# Altium schematic sheet OLED_BREAKOUT_SCH.SchDoc
size A
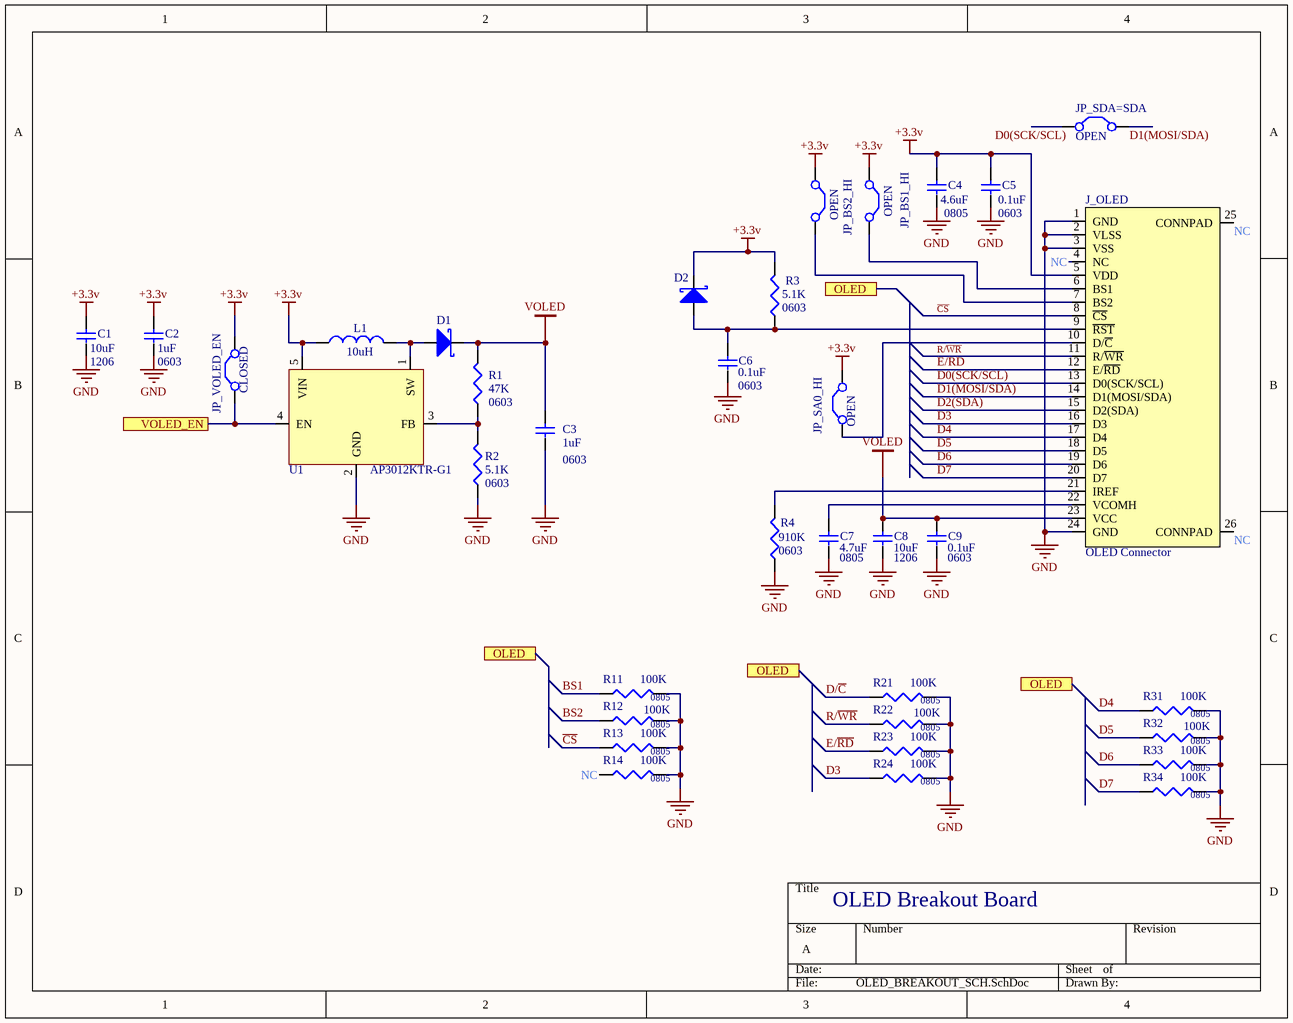
[diagram p0: OLED_BREAKOUT_SCH.SchDoc]

## Parts
C1  Capactiance: 10uF  Size: 1206  [SMD-1206]  (hidden comment: Capacitor)
C2  Capacitance: 1uF  Size: 0603  [SMD-0603]  (hidden comment: Capacitor)
C3  Capacitance: 1uF  Size: 0603  [SMD-0603]  (hidden comment: Capacitor)
C4  Capacitance: 4.6uF  Size: 0805  [SMD-0805]  (hidden comment: Capacitor)
C5  Capacitance: 0.1uF  Size: 0603  [SMD-0603]  (hidden comment: Capacitor)
C6  Capacitance: 0.1uF  Size: 0603  [SMD-0603]  (hidden comment: Capacitor)
C7  Capacitance: 4.7uF  Size: 0805  [SMD-0805]  (hidden comment: Capacitor)
C8  Capacitance: 10uF  Size: 1206  [SMD-1206]  (hidden comment: Capacitor)
C9  Capacitance: 0.1uF  Size: 0603  [SMD-0603]  (hidden comment: Capacitor)
D1  Diode Schottky  [D1_SOD-123]  (value not drawn)
D2  Diode Schottky  [D2_SOD523]  (value not drawn)
J_OLED  OLED Connector  [J_OLED]
JP_BS1_HI  State: OPEN  [SMD-0805]  (hidden comment: Jumper)
JP_BS2_HI  State: OPEN  [SMD-0805]  (hidden comment: Jumper)
JP_SA0_HI  State: OPEN  [SMD-0805]  (hidden comment: Jumper)
JP_SDA=SDA  State: OPEN  [SMD-0805]  (hidden comment: Jumper)
JP_VOLED_EN  State: CLOSED  [SMD-0805]  (hidden comment: Jumper)
L1  Inductance: 10uH  (hidden comment: Inductor)
R1  Resistance: 47K  Size: 0603  [SMD-0603]  (hidden comment: Resistor)
R2  Resistance: 5.1K  Size: 0603  [SMD-0603]  (hidden comment: Resistor)
R3  Resistance: 5.1K  Size: 0603  [SMD-0603]  (hidden comment: Resistor)
R4  Resistance: 910K  Size: 0603  [SMD-0603]  (hidden comment: Resistor)
R11  Resistance: 100K  SIze: 0805  [SMD-0805]  (hidden comment: Resistor)
R12  Resistance: 100K  SIze: 0805  [SMD-0805]  (hidden comment: Resistor)
R13  Resistance: 100K  SIze: 0805  [SMD-0805]  (hidden comment: Resistor)
R14  Resistance: 100K  SIze: 0805  [SMD-0805]  (hidden comment: Resistor)
R21  Resistance: 100K  SIze: 0805  [SMD-0805]  (hidden comment: Resistor)
R22  Resistance: 100K  SIze: 0805  [SMD-0805]  (hidden comment: Resistor)
R23  Resistance: 100K  SIze: 0805  [SMD-0805]  (hidden comment: Resistor)
R24  Resistance: 100K  SIze: 0805  [SMD-0805]  (hidden comment: Resistor)
R31  Resistance: 100K  SIze: 0805  [SMD-0805]  (hidden comment: Resistor)
R32  Resistance: 100K  SIze: 0805  [SMD-0805]  (hidden comment: Resistor)
R33  Resistance: 100K  SIze: 0805  [SMD-0805]  (hidden comment: Resistor)
R34  Resistance: 100K  SIze: 0805  [SMD-0805]  (hidden comment: Resistor)
U1  Part#: AP3012KTR-G1  [U1_SOT-23-5]  (hidden comment: DC/DC Voltage Regulator)

## Ports
OLED, VOLED_EN

## Nets
+3.3v: C1.2 C2.2 C4.2 C5.2 D2.2 J_OLED.5(VDD) JP_BS1_HI.1(C1) JP_BS2_HI.1(C1) JP_SA0_HI.2(C2) JP_VOLED_EN.2(C2) L1.1 R3.2 U1.5(VIN)
GND: C1.1 C2.1 C3.1 C4.1 C5.1 C6.1 C7.1 C8.1 C9.1 J_OLED.1(GND) J_OLED.2(VLSS) J_OLED.3(VSS) J_OLED.24(GND) R2.1 R4.1 R11.2 R12.2 R13.2 R14.2 R21.2 R22.2 R23.2 R24.2 R31.2 R32.2 R33.2 R34.2 U1.2(GND)
VOLED: C3.2 C8.2 C9.2 D1.2 J_OLED.23(VCC) R1.2
BS1: R11.1
BS2: R12.1
~{CS}: J_OLED.8(~{CS}) R13.1
D0(SCK/SCL): J_OLED.13(D0(SCK/SCL)) JP_SDA=SDA.1(C1)
D1(MOSI/SDA): J_OLED.14(D1(MOSI/SDA)) JP_SDA=SDA.2(C2)
D2(SDA): J_OLED.15(D2(SDA))
D3: J_OLED.16(D3) R24.1
D4: J_OLED.17(D4) R31.1
D5: J_OLED.18(D5) R32.1
D6: J_OLED.19(D6) R33.1
D7: J_OLED.20(D7) R34.1
D/~{C}: R21.1
E/~{RD}: J_OLED.12(E/~{RD}) R23.1
NC: J_OLED.4(NC) J_OLED.25(CONNPAD) J_OLED.26(CONNPAD) R14.1
R/~{WR}: J_OLED.11(R/~{WR}) R22.1
VOLED_EN: JP_VOLED_EN.1(C1) U1.4(EN) ; port VOLED_EN
NetC6_2: C6.2 D2.1 J_OLED.9(~{RST}) R3.1
NetC7_2: C7.2 J_OLED.22(VCOMH)
NetD1_1: D1.1 L1.2 U1.1(SW)
NetJ_OLED_6: J_OLED.6(BS1) JP_BS1_HI.2(C2)
NetJ_OLED_7: J_OLED.7(BS2) JP_BS2_HI.2(C2)
NetJ_OLED_10: J_OLED.10(D/~{C}) JP_SA0_HI.1(C1)
NetJ_OLED_21: J_OLED.21(IREF) R4.2
NetR1_1: R1.1 R2.2 U1.3(FB)

## Notes on the sheet
- OLED Breakout Board

## Library data of the parts
J_OLED = OLED Connector: 24 Position, 0.5mm Pitch, Gold, FCC FPC ZIF Connector
JP_BS1_HI JP_BS2_HI JP_SA0_HI JP_SDA=SDA JP_VOLED_EN = Jumper: Jumper Wire; Published: 24-Mar-1999; LatestRevisionDate: 17-Jul-2002; LatestRevisionNote: Re-released for DXP Platform.; PackageReference: RAD-0.2; Publisher: Altium Limited; PackageDescription: Radial Cap, Thru-Hole; 2 Leads; 0.2 in Pin Spacing
U1 = DC/DC Voltage Regulator: Integrated Circuits (ICs) / PMIC - Voltage Regulators - DC DC Switching Regulators